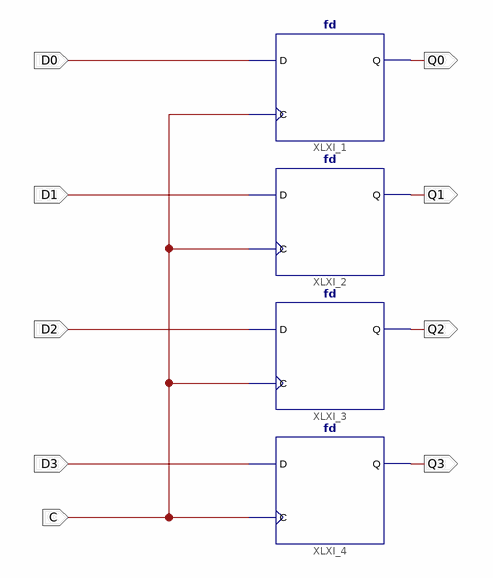
[diagram p0: schematic sheet 1]
// Xilinx ISE schematic FD4.sch (spartan3) as structural Verilog: 4 symbols, 9 ports
module FD4 (
  input  D0,
  input  D1,
  input  D2,
  input  D3,
  input  C,
  output Q0,
  output Q1,
  output Q2,
  output Q3
);

  fd XLXI_1 (.C(C), .D(D0), .Q(Q0));
  fd XLXI_2 (.C(C), .D(D1), .Q(Q1));
  fd XLXI_3 (.C(C), .D(D2), .Q(Q2));
  fd XLXI_4 (.C(C), .D(D3), .Q(Q3));
endmodule
